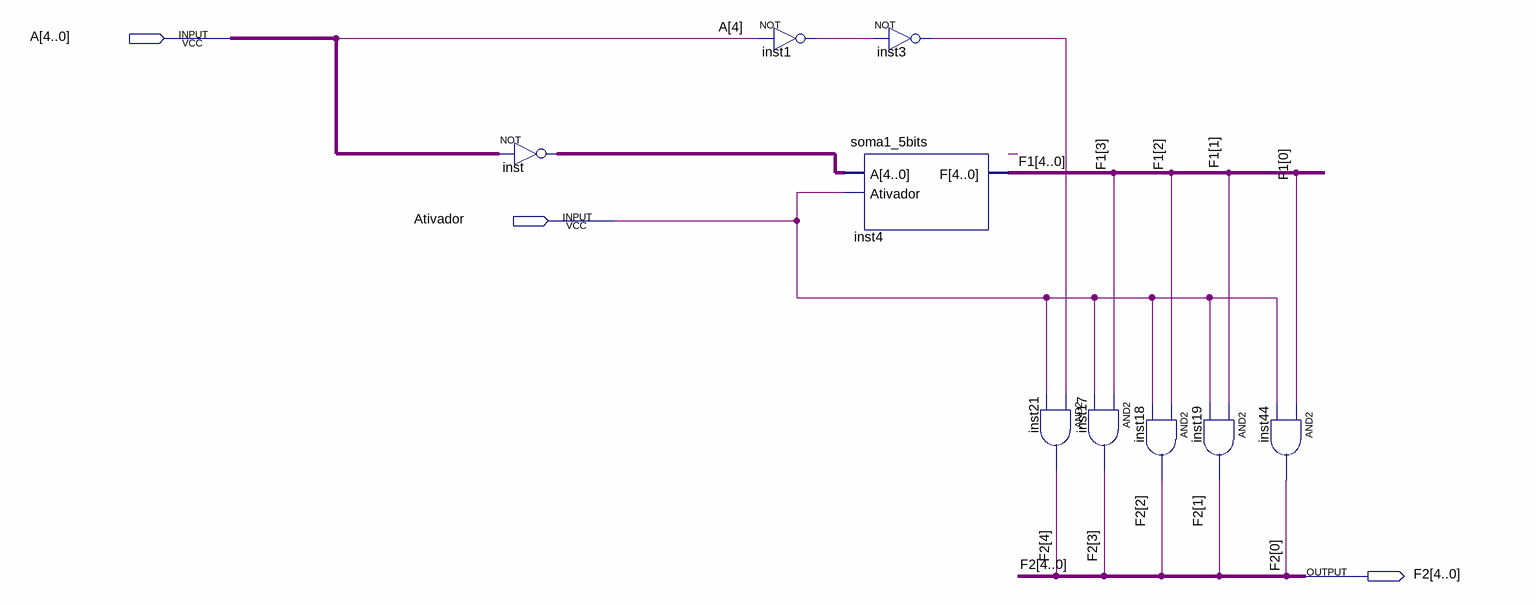
[diagram p0: schematic sheet]
// Quartus schematic Complemento_de_2.bdf as structural Verilog: 9 symbols, 3 pins
module Complemento_de_2 (
  input  [4:0] A,
  input  Ativador,
  output [4:0] F2
);

  wire inst1_out, inst3_out;
  wire [4:0] F1, inst_out;

  assign inst_out = ~A;  // NOT inst, 5 bits wide
  not inst1 (inst1_out, A[4]);
  not inst3 (inst3_out, inst1_out);
  soma1_5bits inst4 (.A(inst_out), .Ativador(Ativador), .F(F1));
  and inst21 (F2[4], inst3_out, Ativador);
  and inst17 (F2[3], F1[3], Ativador);
  and inst18 (F2[2], F1[2], Ativador);
  and inst19 (F2[1], F1[1], Ativador);
  and inst44 (F2[0], F1[0], Ativador);
endmodule
